# EAGLE design SparkFun_ESP32_Power_Control_Shield (EAGLE 7.7.0)
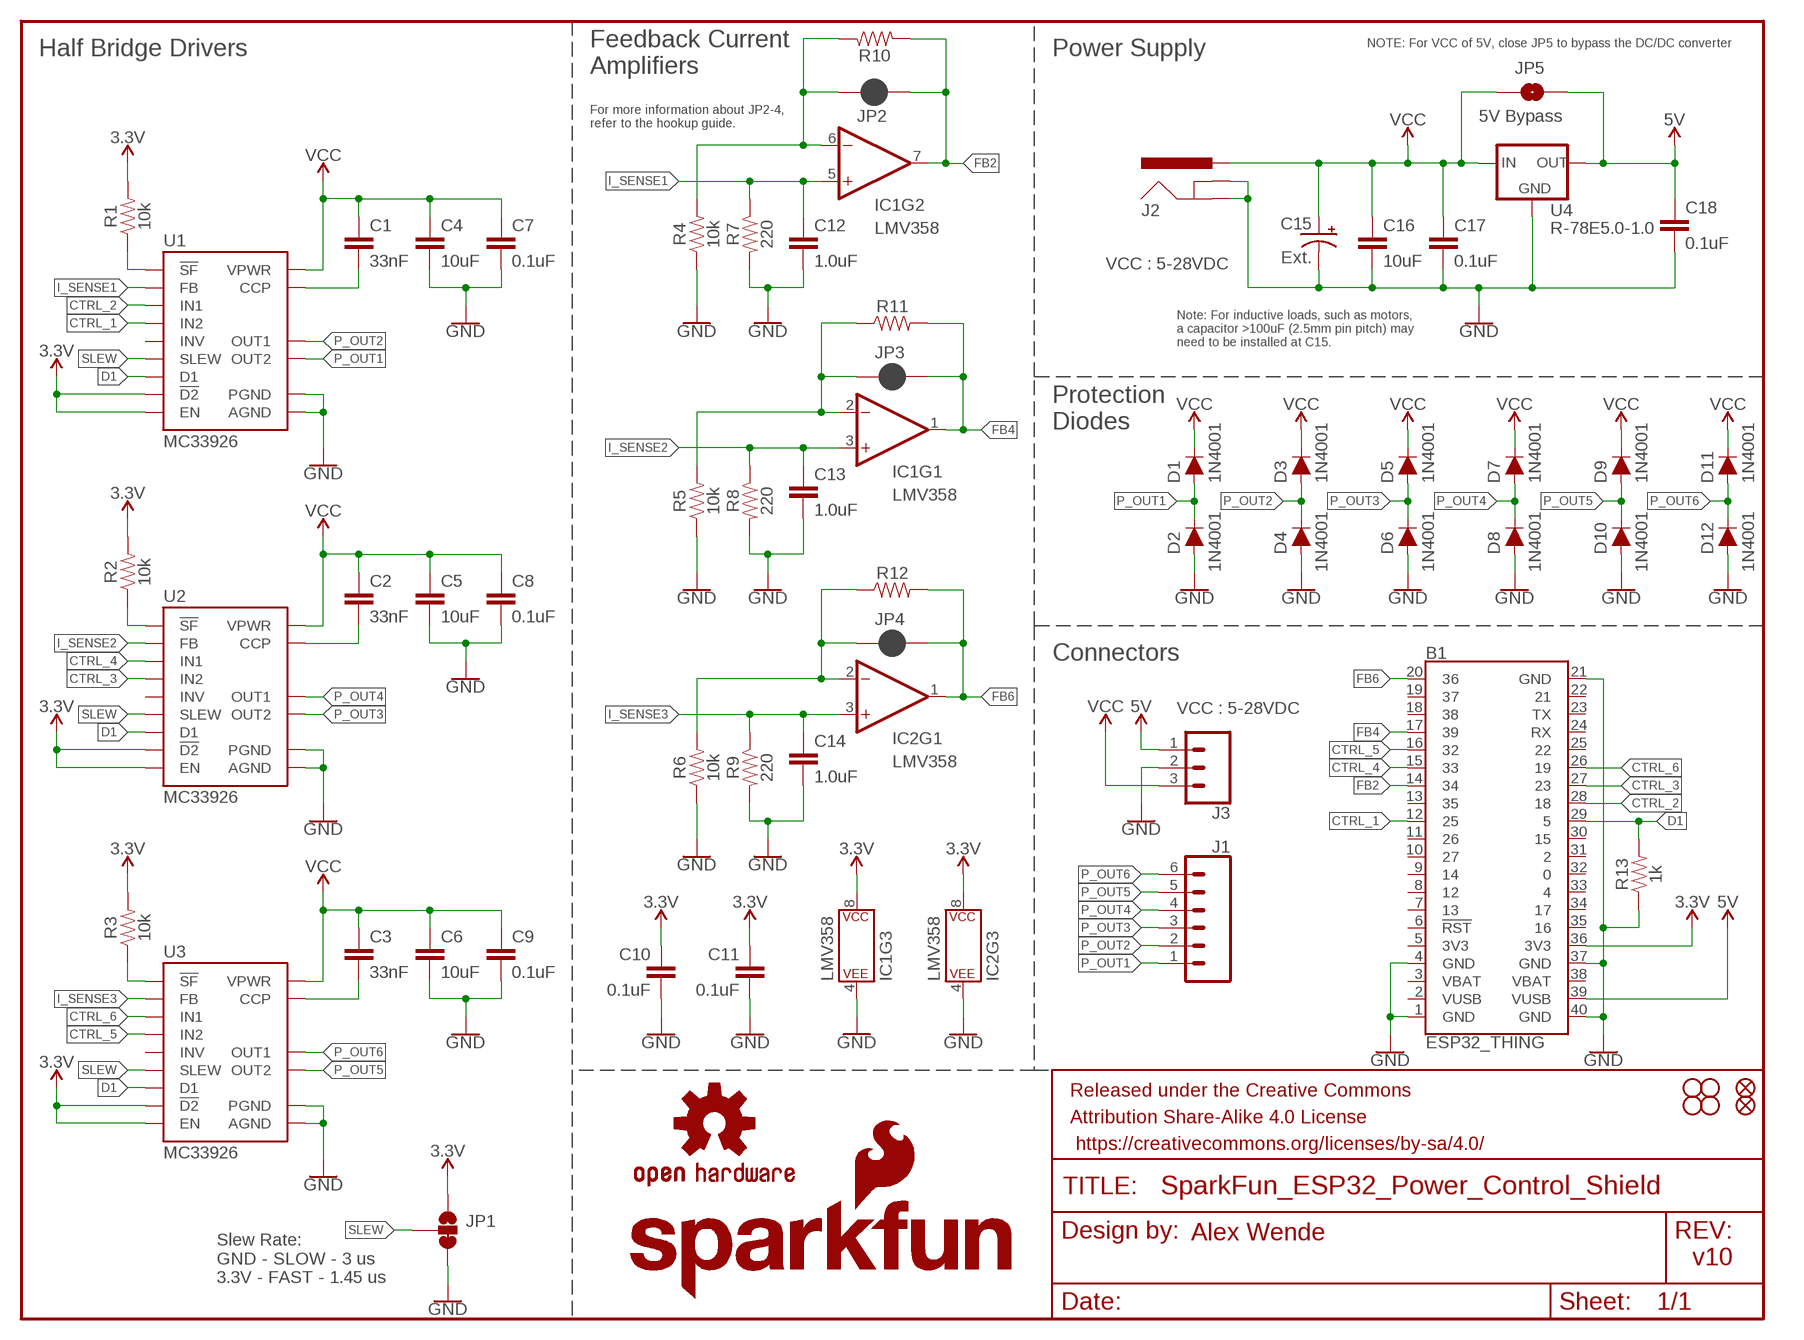
[diagram p0: schematic, sheet 1]

## Parts
B1  ESP32_THING  [ESP32_THING]
C1  33nF  33NF-0603-50V-10%  [0603]
C2  33nF  33NF-0603-50V-10%  [0603]
C3  33nF  33NF-0603-50V-10%  [0603]
C4  10uF  10UF-1210-50V-20%  [1210]
C5  10uF  10UF-1210-50V-20%  [1210]
C6  10uF  10UF-1210-50V-20%  [1210]
C7  0.1uF  0.1UF-0603-100V-10%  [0603]
C8  0.1uF  0.1UF-0603-100V-10%  [0603]
C9  0.1uF  0.1UF-0603-100V-10%  [0603]
C10  0.1uF  0.1UF-0603-100V-10%  [0603]
C11  0.1uF  0.1UF-0603-100V-10%  [0603]
C12  1.0uF  1.0UF-0603-16V-10%  [0603]
C13  1.0uF  1.0UF-0603-16V-10%  [0603]
C14  1.0uF  1.0UF-0603-16V-10%  [0603]
C15  Ext.  100UF-POLAR-RADIAL-2.5MM-25V-20%  [CPOL-RADIAL-2.5MM-6.5MM]
C16  10uF  10UF-1210-50V-20%  [1210]
C17  0.1uF  0.1UF-0603-100V-10%  [0603]
C18  0.1uF  0.1UF-0603-100V-10%  [0603]
D1  1N4001  DIODE-PTH  [DIODE-1N4001]
D2  1N4001  DIODE-PTH  [DIODE-1N4001]
D3  1N4001  DIODE-PTH  [DIODE-1N4001]
D4  1N4001  DIODE-PTH  [DIODE-1N4001]
D5  1N4001  DIODE-PTH  [DIODE-1N4001]
D6  1N4001  DIODE-PTH  [DIODE-1N4001]
D7  1N4001  DIODE-PTH  [DIODE-1N4001]
D8  1N4001  DIODE-PTH  [DIODE-1N4001]
D9  1N4001  DIODE-PTH  [DIODE-1N4001]
D10  1N4001  DIODE-PTH  [DIODE-1N4001]
D11  1N4001  DIODE-PTH  [DIODE-1N4001]
D12  1N4001  DIODE-PTH  [DIODE-1N4001]
FD1  FIDUCIALUFIDUCIAL  [FIDUCIAL-MICRO]
FD2  FIDUCIALUFIDUCIAL  [FIDUCIAL-MICRO]
FRAME1  FRAME-LETTER  [CREATIVE_COMMONS]
H1  STAND-OFF  [STAND-OFF]
H2  STAND-OFF  [STAND-OFF]
H3  STAND-OFF  [STAND-OFF]
H4  STAND-OFF  [STAND-OFF]
IC1  LMV358  OPAMP-DUALU  [SO08]
IC2  LMV358  OPAMP-DUALU  [SO08]
J1  CONN_063.5MM-6  [SCREWTERMINAL-3.5MM-6]
J2  POWER_JACKPTH_LOCK  [POWER_JACK_PTH_LOCK]
J3  CONN_03SCREW  [SCREWTERMINAL-3.5MM-3]
JP1  JUMPER-SMT_3_1-NC_TRACE_SILK  [SMT-JUMPER_3_1-NC_TRACE_SILK]
JP2  JUMPER-SMT_2_NC_PASTE_NO-SILK  [SMT-JUMPER_2_NC_PASTE_NO-SILK]
JP3  JUMPER-SMT_2_NC_PASTE_NO-SILK  [SMT-JUMPER_2_NC_PASTE_NO-SILK]
JP4  JUMPER-SMT_2_NC_PASTE_NO-SILK  [SMT-JUMPER_2_NC_PASTE_NO-SILK]
JP5  5V Bypass  JUMPER-SMT_2_NO_SILK  [SMT-JUMPER_2_NO_SILK]
LOGO1  SFE_LOGO_NAME_FLAME.2_INCH  [SFE_LOGO_NAME_FLAME_.2]
LOGO2  OSHW-LOGOM  [OSHW-LOGO-M]
R1  10k  10KOHM-0603-1/10W-1%  [0603]
R2  10k  10KOHM-0603-1/10W-1%  [0603]
R3  10k  10KOHM-0603-1/10W-1%  [0603]
R4  10k  10KOHM-0603-1/10W-1%  [0603]
R5  10k  10KOHM-0603-1/10W-1%  [0603]
R6  10k  10KOHM-0603-1/10W-1%  [0603]
R7  220  220OHM-0603-1/10W-1%  [0603]
R8  220  220OHM-0603-1/10W-1%  [0603]
R9  220  220OHM-0603-1/10W-1%  [0603]
R10  1KOHM-HORIZ-1/4W-1%  [AXIAL-0.3]
R11  1KOHM-HORIZ-1/4W-1%  [AXIAL-0.3]
R12  1KOHM-HORIZ-1/4W-1%  [AXIAL-0.3]
R13  1k  1KOHM-0603-1/10W-1%  [0603]
U1  MC33926  [32-PQFN]
U2  MC33926  [32-PQFN]
U3  MC33926  [32-PQFN]
U4  R-78E5.0-1.0  [DC-DC_CONVERTER_78XX]

## Nets
3.3V: B1.36(3V3) C10.1 C11.1 IC1.8(P$V+) IC2.8(P$V+) JP1.1 R1.2 R2.2 R3.2 U1.P$10(EN) U1.P$16(!D2) U2.P$10(EN) U2.P$16(!D2) U3.P$10(EN) U3.P$16(!D2)
5V: B1.39(VUSB) C18.1 J3.1 JP5.2 U4.VOUT(OUT)
CTRL_1: B1.12 U1.P$1(IN2)
CTRL_2: B1.28 U1.P$2(IN1)
CTRL_3: B1.27 U2.P$1(IN2)
CTRL_4: B1.15 U2.P$2(IN1)
CTRL_5: B1.16 U3.P$1(IN2)
CTRL_6: B1.26 U3.P$2(IN1)
D1: B1.29 R13.2 U1.P$26(D1) U2.P$26(D1) U3.P$26(D1)
FB2: B1.14 IC1.7(OUT) JP2.2 R10.P$2
FB4: B1.17 IC1.1(OUT) JP3.2 R11.P$2
FB6: B1.20 IC2.1(OUT) JP4.2 R12.P$2
GND: B1.1(GND) B1.4(GND) B1.21(GND) B1.37(GND) B1.40(GND) C4.2 C5.2 C6.2 C7.2 C8.2 C9.2 C10.2 C11.2 C12.2 C13.2 C14.2 C15.2(-) C16.2 C17.2 C18.2 D2.A D4.A D6.A D8.A D10.A D12.A IC1.4(P$V-) IC2.4(P$V-) J2.GND J2.GNDBREAK J3.2 JP1.3 R4.1 R5.1 R6.1 R7.2 R8.2 R9.2 R13.1 U1.P$5(AGND) U1.P$18(PGND) U1.P$19(PGND) U1.P$20(PGND) U1.P$22(PGND) U1.P$23(PGND) U1.P$24(PGND) U1.P$33(AGND) U2.P$5(AGND) U2.P$18(PGND) U2.P$19(PGND) U2.P$20(PGND) U2.P$22(PGND) U2.P$23(PGND) U2.P$24(PGND) U2.P$33(AGND) U3.P$5(AGND) U3.P$18(PGND) U3.P$19(PGND) U3.P$20(PGND) U3.P$22(PGND) U3.P$23(PGND) U3.P$24(PGND) U3.P$33(AGND) U4.GND
I_SENSE1: C12.1 IC1.5(+IN) R7.1 U1.P$8(FB)
I_SENSE2: C13.1 IC1.3(+IN) R8.1 U2.P$8(FB)
I_SENSE3: C14.1 IC2.3(+IN) R9.1 U3.P$8(FB)
N$2: IC1.6(-IN) JP2.1 R4.2 R10.P$1
N$4: IC2.2(-IN) JP4.1 R6.2 R12.P$1
N$5: IC1.2(-IN) JP3.1 R5.2 R11.P$1
N$6: R2.1 U2.P$21(!SF)
N$7: C2.2 U2.P$32(CCP)
N$9: R3.1 U3.P$21(!SF)
N$10: R1.1 U1.P$21(!SF)
N$11: C1.2 U1.P$32(CCP)
N$12: C3.2 U3.P$32(CCP)
P_OUT1: D1.A D2.C J1.1 U1.P$27(OUT2) U1.P$28(OUT2) U1.P$29(OUT2) U1.P$30(OUT2)
P_OUT2: D3.A D4.C J1.2 U1.P$12(OUT1) U1.P$13(OUT1) U1.P$14(OUT1) U1.P$15(OUT1)
P_OUT3: D5.A D6.C J1.3 U2.P$27(OUT2) U2.P$28(OUT2) U2.P$29(OUT2) U2.P$30(OUT2)
P_OUT4: D7.A D8.C J1.4 U2.P$12(OUT1) U2.P$13(OUT1) U2.P$14(OUT1) U2.P$15(OUT1)
P_OUT5: D9.A D10.C J1.5 U3.P$27(OUT2) U3.P$28(OUT2) U3.P$29(OUT2) U3.P$30(OUT2)
P_OUT6: D11.A D12.C J1.6 U3.P$12(OUT1) U3.P$13(OUT1) U3.P$14(OUT1) U3.P$15(OUT1)
SLEW: JP1.2 U1.P$3(SLEW) U2.P$3(SLEW) U3.P$3(SLEW)
VCC: C1.1 C2.1 C3.1 C4.1 C5.1 C6.1 C7.1 C8.1 C9.1 C15.1(+) C16.1 C17.1 D1.C D3.C D5.C D7.C D9.C D11.C J2.PWR J3.3 JP5.1 U1.P$4(VPWR) U1.P$6(VPWR) U1.P$11(VPWR) U1.P$31(VPWR) U2.P$4(VPWR) U2.P$6(VPWR) U2.P$11(VPWR) U2.P$31(VPWR) U3.P$4(VPWR) U3.P$6(VPWR) U3.P$11(VPWR) U3.P$31(VPWR) U4.VIN(IN)
Unconnected: B1.2(VUSB) B1.3(VBAT) B1.5(3V3) B1.6(!RST!) B1.7 B1.8 B1.9 B1.10 B1.11 B1.13 B1.18 B1.19 B1.22 B1.23(TX) B1.24(RX) B1.25 B1.30 B1.31 B1.32 B1.33 B1.34 B1.35 B1.38(VBAT) IC2.5(+IN) IC2.6(-IN) IC2.7(OUT) U1.P$7(INV) U2.P$7(INV) U3.P$7(INV)

## Notes on the sheet
- NOTE: For VCC of 5V, close JP5 to bypass the DC/DC converter
- Half Bridge Drivers | Power Supply
- Feedback Current
  Amplifiers
- For more information about JP2-4,
  refer to the hookup guide.
- VCC : 5-28VDC
- Note: For inductive loads, such as motors,
  a capacitor >100uF (2.5mm pin pitch) may
  need to be installed at C15.
- Protection
  Diodes
- Connectors
- VCC : 5-28VDC
- Alex Wende
- v10
- Slew Rate:
  GND - SLOW - 3 us
  3.3V - FAST - 1.45 us

## Library data of the parts
B1 = SparkFun-Boards:ESP32_THING: SparkFun ESP32 Thing Board Pins, silkscreen, and logos matching the layout of the SparkFun ESP32 Thing <https://www.sparkfun.com/products/13907> Dimensions: 2.32" x 1.00"; SF_ID: DEV-13907
C1-C3 = SparkFun-Capacitors:33NF: 33nF ceramic capacitors A capacitor is a passive two-terminal electrical component used to store electrical energy temporarily in an electric field.; PROD_ID: CAP-07887
C4-C6 C16 = SparkFun-Capacitors:10UF: 10.0µF ceramic capacitors A capacitor is a passive two-terminal electrical component used to store electrical energy temporarily in an electric field.; PROD_ID: CAP-09824
C7-C11 C17 C18 = SparkFun-Capacitors:0.1UF: 0.1µF ceramic capacitors A capacitor is a passive two-terminal electrical component used to store electrical energy temporarily in an electric field.; PROD_ID: CAP-08390
C12-C14 = SparkFun-Capacitors:1.0UF: 1µF ceramic capacitors A capacitor is a passive two-terminal electrical component used to store electrical energy temporarily in an electric field.; PROD_ID: CAP-00868
C15 = SparkFun-Capacitors:100UF-POLAR: 100µF polarized capacitors A capacitor is a passive two-terminal electrical component used to store electrical energy temporarily in an electric field.; PROD_ID: CAP-08439; VALUE: 100uF
D1-D12 = SparkFun-DiscreteSemi:DIODE: Diode These are standard reverse protection diodes and small signal diodes. SparkFun Products: SparkFun SparkPunk Sound Kit <https://www.sparkfun.com/products/11177> SparkFun ESP8266 Thing <https://www.sparkfun.com/products/13231>; PROD_ID: DIO-09176; VALUE: 1A/50V/1.1V
FD1 FD2 = SparkFun-Aesthetics:FIDUCIAL: Fiducial Alignment Points Point-of-reference for pick-and-place machines and other optical instruments.
FRAME1 = SparkFun-Aesthetics:FRAME-LETTER: Schematic Frame - Letter Standard 8.5x11 US Letter frame
H1-H4 = SparkFun-Hardware:STAND-OFF: Stand Off Drill holes for mechanically mounting via screws, standoffs, etc. Note: Use the keepout ring to avoid running the screw head into surrounding components. Variant Overviews STAND-OFF - Mechanical footprint for a #4 phillips button head screw. STAND-OFF-TIGHT - Mechanical footprint for a #4 phillips button head screw, Example SparkFun Products Screw - Phillips Head (1/4", 4-40, 10 pack) <https://www.sparkfun.com/products/10453> (PRT-10453) Screw - Phillips Head (1/2", 4-40, 10 pack) <https://www.sparkfun.com/products/10452> (PRT-10452) Screw - Phillips Head (3/4", 4-40, 10 pack) <https://www.sparkfun.com/products/10451> (PRT-10451) Screw - Phillips Head (1", 4-40, 10 pack) <https://www.sparkfun.com/products/10450> (PRT-10450)
IC1 IC2 = SparkFun-IC-Amplifiers:OPAMP-DUAL: Generic op-amp footprint This component is for the standard 358 pinning of a dual op-amp From the LM358 datasheet: Pin 1: Output A Pin 2: Inverting Input A Pin 3: Non-Inverting Input A Pin 4: Gnd Pin 5: Non-Inverting Input B Pin 6: Inverting Input B Pin 7: Output B Pin 8: V+; PROD_ID: IC-09657; VALUE: OP-AMP
J1 = SparkFun-Connectors:CONN_06: Multi connection point. Often used as Generic Header-pin footprint for 0.1 inch spaced/style header connections On any of the 0.1 inch spaced packages, you can populate with these: Break Away Headers - Straight <https://www.sparkfun.com/products/116> (PRT-00116) Break Away Male Headers - Right Angle <https://www.sparkfun.com/products/553> (PRT-00553) Female Headers <https://www.sparkfun.com/products/115> (PRT-00115) Break Away Headers - Machine Pin <https://www.sparkfun.com/products/117> (PRT-00117) Break Away Female Headers - Swiss Machine Pin <https://www.sparkfun.com/products/743> (PRT-00743) Arduino Stackable Header - 6 Pin <https://www.sparkfun.com/products/9280> (PRT-09280) For SCREWTERMINALS and SPRING TERMINALS visit here: Screw Terimnals on SparkFun.com <https://www.sparkfun.com/search/results?term=Screw+Terminals> (5mm/3.5mm/2.54mm spacing) This device is also useful as a general connection point to wire up your design to another part of your project. Our various solder wires solder well into these plated through hole pads. Hook-Up Wire - Assortment (Stranded, 22 AWG) <https://www.sparkfun.com/products/11375> (PRT-11375) Hook-Up Wire - Assortment (Solid Core, 22 AWG) <https://www.sparkfun.com/products/11367> (PRT-11367) View the entire wire category on our website here <https://www.sparkfun.com/categories/141>; PROD_ID: CONN-13617
J2 = SparkFun-Connectors:POWER_JACK: Power Jack Connector This is the standard 5.5mm barrel jack for power. The PTH is the most common, proven, reliable, footprint. The Slot footprint only works if the mill layer is transmitted to the PCB fab house so be warned. Here are the connectors we sell at SparkFun: DC Barrel Power Jack/Connector <https://www.sparkfun.com/products/119> (PRT-00119) DC Barrel Power Jack/Connector (SMD) <https://www.sparkfun.com/products/12748> (PRT-12748) DC Barrel Jack Adapter - Breadboard Compatible <https://www.sparkfun.com/products/10811> (PRT-10811) It is used on this SparkFun product (and many, many others): SparkFun RedBoard - Programmed with Arduino <https://www.sparkfun.com/products/12757> (DEV-12757) Also, if you need a mating power supply or connector, please check these out: Wall Adapter Power Supply - 9VDC 650mA <https://www.sparkfun.com/products/298> (TOL-00298) DC Barrel Jack Adapter - Male <https://www.sparkfun.com/products/10287> (PRT-10287); PROD_ID: CONN-08197; SF_ID: PRT-00119
J3 = SparkFun-Connectors:CONN_03: Multi connection point. Often used as Generic Header-pin footprint for 0.1 inch spaced/style header connections On any of the 0.1 inch spaced packages, you can populate with these: Break Away Headers - Straight <https://www.sparkfun.com/products/116> (PRT-00116) Break Away Male Headers - Right Angle <https://www.sparkfun.com/products/553> (PRT-00553) Female Headers <https://www.sparkfun.com/products/115> (PRT-00115) Break Away Headers - Machine Pin <https://www.sparkfun.com/products/117> (PRT-00117) Break Away Female Headers - Swiss Machine Pin <https://www.sparkfun.com/products/743> (PRT-00743) Stackable Header - 3 Pin (Female, 0.1") <https://www.sparkfun.com/products/13875> (PRT-13875) For SCREWTERMINALS and SPRING TERMINALS visit here: Screw Terimnals on SparkFun.com <https://www.sparkfun.com/search/results?term=Screw+Terminals> (5mm/3.5mm/2.54mm spacing) This device is also useful as a general connection point to wire up your design to another part of your project. Our various solder wires solder well into these plated through hole pads. Hook-Up Wire - Assortment (Stranded, 22 AWG) <https://www.sparkfun.com/products/11375> (PRT-11375) Hook-Up Wire - Assortment (Solid Core, 22 AWG) <https://www.sparkfun.com/products/11367> (PRT-11367) View the entire wire category on our website here <https://www.sparkfun.com/categories/141> Special notes: Molex polarized connector foot print use with SKU : PRT-08232 with associated crimp pins and housings.; PROD_ID: CONN-08288; SF_ID: PRT-08235
JP1 = SparkFun-Jumpers:JUMPER-SMT_3_1-NC_TRACE: Normally closed trace jumper (1 of 2 connections) This jumper has a trace between two pads so it's normally closed (NC). The other connection is normally open (NO). Use a razor knife to open the connection. For best results follow the IPC guidelines for cutting traces: Cutout at least 0.063 mm (0.005 in). Remove all loose material to clean up the cut area. Seal the cut with an approved epoxy. Reapply solder to reclose the connection, or to close the NO connection.
JP2-JP4 = SparkFun-Jumpers:JUMPER-SMT_2_NC_PASTE: Normally closed solder jumper This jumper has an aperture in the stencil to allow solder paste to bridge the split in the wire so it's normally closed (NC). Wick off the solder to open the connection. Reapply solder to reclose the connection.
JP5 = SparkFun-Jumpers:JUMPER-SMT_2_NO: Normally open jumper This jumper has two pads in close proximity to each other. Apply solder to close the connection. Round pads are easier to solder for beginners, but are a lot larger. SparkFun Product that uses the round pads: SparkFun EL Sequencer <https://www.sparkfun.com/products/12781>
LOGO1 = SparkFun-Aesthetics:SFE_LOGO_NAME_FLAME: SparkFun Font Logo w/ Flame This is the SparkFun full logo. The logo on the schematic will always be the same size; the package variant is the height of the flame part of the logo. Default layer for the logo on the board is tSilk.
LOGO2 = SparkFun-Aesthetics:OSHW-LOGO: Open-Source Hardware (OSHW) Logo This logo indicates the piece of hardware it is found on incorporates a OSHW license and/or adheres to the definition of open source hardware found here: http://freedomdefined.org/OSHW
R1-R6 = SparkFun-Resistors:10KOHM: 10kΩ resistor A resistor is a passive two-terminal electrical component that implements electrical resistance as a circuit element. Resistors act to reduce current flow, and, at the same time, act to lower voltage levels within circuits. - Wikipedia; PROD_ID: RES-00824
R7-R9 = SparkFun-Resistors:220OHM: 220Ω resistor A resistor is a passive two-terminal electrical component that implements electrical resistance as a circuit element. Resistors act to reduce current flow, and, at the same time, act to lower voltage levels within circuits. - Wikipedia; PROD_ID: RES-07861
R10-R12 = SparkFun-Resistors:1KOHM: 1kΩ resistor A resistor is a passive two-terminal electrical component that implements electrical resistance as a circuit element. Resistors act to reduce current flow, and, at the same time, act to lower voltage levels within circuits. - Wikipedia; PROD_ID: RES-12182; VALUE: 1k
R13 = SparkFun-Resistors:1KOHM: 1kΩ resistor A resistor is a passive two-terminal electrical component that implements electrical resistance as a circuit element. Resistors act to reduce current flow, and, at the same time, act to lower voltage levels within circuits. - Wikipedia; PROD_ID: RES-07856
U1-U3 = SparkFun_ESP32_Power_Control_Shield_Temp:MC33926; PROD_ID: IC-13616
U4 = SparkFun-IC-Power:R-78E5.0-1.0: Recom Power 5V 1A DC/DC Converter The Recom R-78E5.0-X.X is a compact DC/DC converter module that is a pin for pin drop-in replacement for the LM7805 linear voltage regulator. Specifications: Input Range: 7-28V Output Voltage: 5V Output Current: 1A Max Efficiency: 91% Datasheet <https://www.recom-power.com/pdf/Innoline/R-78Exx-1.0.pdf>; PROD_ID: COM-13655

## Board
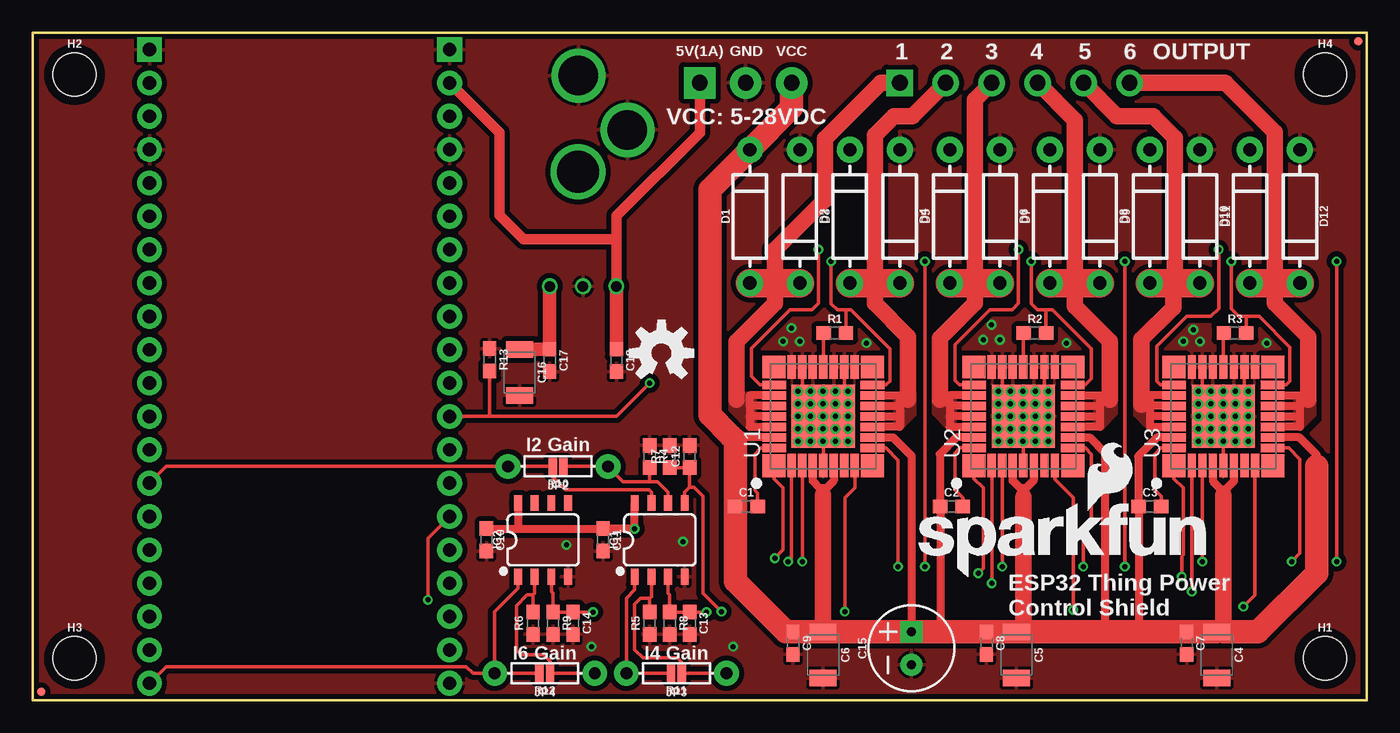
[diagram p1: board, top side]
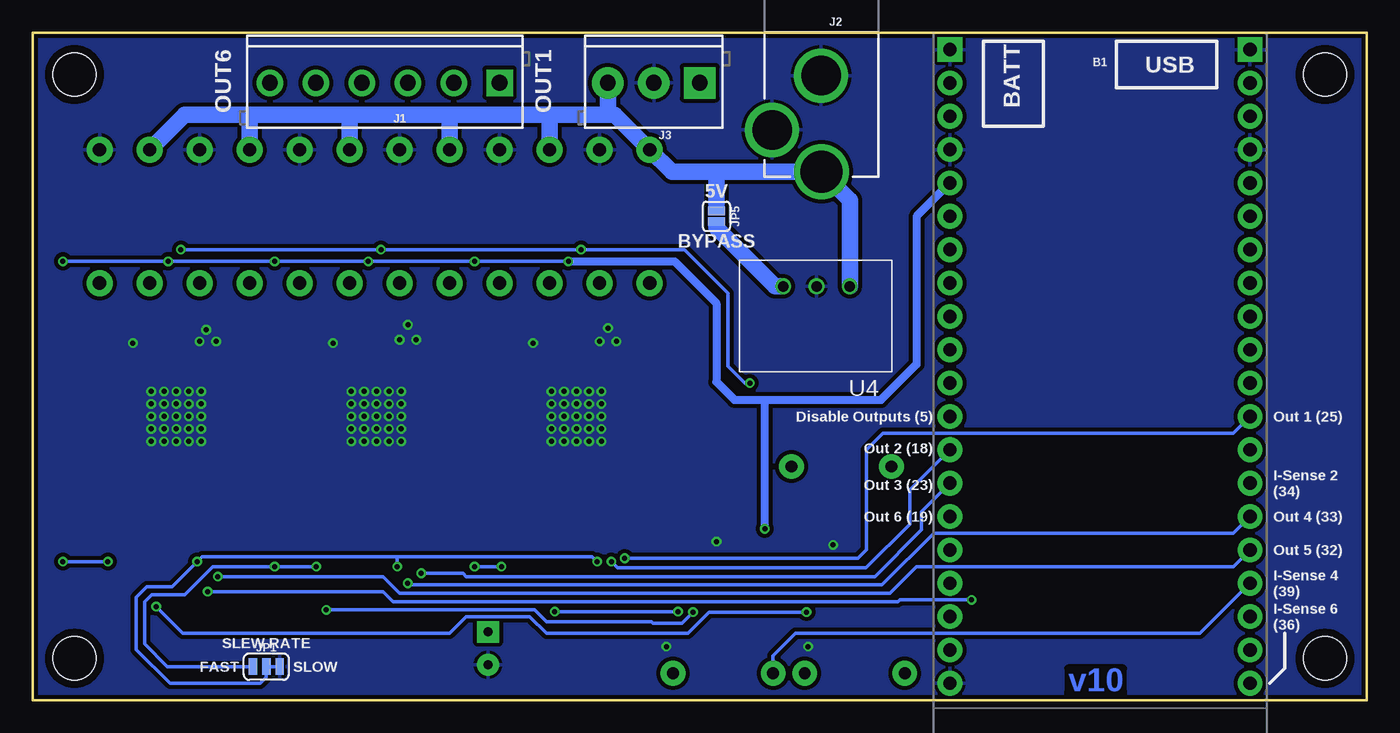
[diagram p2: board, bottom side, seen from below]

Size 101.6 x 50.8 mm. Coordinates in mm from the lower left corner, seen from the top.
Outline: 0,0 101.6,0 101.6,50.8 0,50.8 0,0
Copper layers (1*16): Top 0.035mm / dielectric 1.5mm / Bottom 0.035mm
Design rules "SparkFun-2-layer-TIGHT": minimum track width 7mil, minimum drill 15mil, track to track 7mil, track to pad 7mil, pad to pad 7mil, via to via 7mil, smd to smd 7mil, copper to edge 7mil, drill to drill 7mil, minimum pad ring 7mil, minimum via ring 7mil, stop-mask expansion 4mil, vias tented up to drill 25mil, thermal gap 10mil

### Footprints (pad centres in the part's own frame; a part is rotated, then mirrored left to right if it is on the bottom)
ESP32_THING = drill 1.016 pad 1.88 square: 1 1.27,1.27; 40 24.13,1.27 | drill 1.016 pad 1.88: 2 1.27,3.81; 3 1.27,6.35; 4 1.27,8.89; 5 1.27,11.43; 6 1.27,13.97; 7 1.27,16.51; 8 1.27,19.05; 9 1.27,21.59; 10 1.27,24.13; 11 1.27,26.67; 12 1.27,29.21; 13 1.27,31.75; 14 1.27,34.29; 15 1.27,36.83; 16 1.27,39.37; 17 1.27,41.91; 18 1.27,44.45; 19 1.27,46.99; 20 1.27,49.53; 21 24.13,49.53; 22 24.13,46.99; 23 24.13,44.45; 24 24.13,41.91; 25 24.13,39.37; 26 24.13,36.83; 27 24.13,34.29; 28 24.13,31.75; 29 24.13,29.21; 30 24.13,26.67; 31 24.13,24.13; 32 24.13,21.59; 33 24.13,19.05; 34 24.13,16.51; 35 24.13,13.97; 36 24.13,11.43; 37 24.13,8.89; 38 24.13,6.35; 39 24.13,3.81
0603 = smd 1.1 x 1: 1 -0.85,0; 2 0.85,0
1210 = smd 1.27 x 2.06: 1 -1.755,0; 2 1.755,0
CPOL-RADIAL-2.5MM-6.5MM = drill 0.7 pad 1.651 square: 1 1.25,0 | drill 0.7 pad 1.651: 2 -1.25,0
DIODE-1N4001 = drill 1 pad 1.981: A -5.08,0; C 5.08,0
FIDUCIAL-MICRO = smd 0.635 x 0.635: 1 0,0
STAND-OFF = hole 3.302: 0,0
SO08 = smd 0.6 x 1.2: 1 -1.905,-2.8; 2 -0.635,-2.8; 3 0.635,-2.8; 4 1.905,-2.8; 5 1.905,2.8; 6 0.635,2.8; 7 -0.635,2.8; 8 -1.905,2.8
SCREWTERMINAL-3.5MM-6 = drill 1.2 pad 2.032 square: 1 0,0 | drill 1.2 pad 2.032: 2 3.5,0; 3 7,0; 4 10.5,0; 5 14,0; 6 17.5,0
POWER_JACK_PTH_LOCK = drill 2.997 pad 4.115: GND 0.025,6.557; GNDBREAK 3.762,10.7 | drill 3.2 pad 4.115: PWR 0,13.878
SCREWTERMINAL-3.5MM-3 = drill 1.2 pad 2.413 square: 1 0,0 | drill 1.2 pad 2.413: 2 3.5,0; 3 7,0
SMT-JUMPER_3_1-NC_TRACE_SILK = smd 0.635 x 1.27: 1 -1.016,0; 2 0,0; 3 1.016,0
SMT-JUMPER_2_NC_PASTE_NO-SILK = smd 0.635 x 1.27: 1 -0.406,0; 2 0.406,0
SMT-JUMPER_2_NO_SILK = smd 0.635 x 1.27: 1 -0.406,0; 2 0.406,0
AXIAL-0.3 = drill 0.9 pad 1.88: P$1 -3.81,0; P$2 3.81,0
32-PQFN = smd 1.75 x 1.75: P$1 -3.754,3.753; P$9 -3.754,-3.767; P$17 3.766,-3.767; P$25 3.766,3.753 | smd 1.8 x 0.635: P$2 -3.74,2.393; P$3 -3.74,1.593; P$4 -3.74,0.793; P$5 -3.74,-0.007; P$6 -3.74,-0.807; P$7 -3.74,-1.607; P$8 -3.74,-2.407; P$18 3.752,-2.407; P$19 3.752,-1.607; P$20 3.752,-0.807; P$21 3.752,-0.007; P$22 3.752,0.793; P$23 3.752,1.593; P$24 3.752,2.393 | smd 0.635 x 1.8: P$10 -2.394,-3.753; P$11 -1.594,-3.753; P$12 -0.794,-3.753; P$13 0.006,-3.753; P$14 0.806,-3.753; P$15 1.606,-3.753; P$16 2.406,-3.753; P$26 2.406,3.739; P$27 1.606,3.739; P$28 0.806,3.739; P$29 0.006,3.739; P$30 -0.794,3.739; P$31 -1.594,3.739; P$32 -2.394,3.739 | smd 4.8 x 4.8: P$33 0.006,-0.007
DC-DC_CONVERTER_78XX = drill 0.8: GND 0,0; VIN -2.54,0; VOUT 2.54,0

### Placement (x,y rotation side)
B1  7.62,50.8 180 bottom
C1  54.36,14.73 0 top
C2  69.98,14.73 0 top
C3  85.09,14.73 0 top
C4  90.17,3.43 270 top
C5  74.93,3.43 270 top
C6  60.2,3.43 270 top
C7  87.88,4.33 270 top
C8  72.64,4.33 270 top
C9  57.91,4.33 270 top
C10  34.54,12.19 270 top
C11  43.43,12.19 270 top
C12  50.04,18.54 90 top
C13  50.04,5.84 270 top
C14  41.15,5.84 270 top
C15  66.93,3.94 90 top
C16  37.08,24.94 270 top
C17  39.37,25.86 270 top
C18  44.45,25.86 270 top
D1  54.61,36.83 90 top
D2  58.42,36.83 270 top
D3  62.23,36.83 90 top
D4  66.04,36.83 270 top
D5  69.85,36.83 90 top
D6  73.66,36.83 270 top
D7  77.47,36.83 90 top
D8  81.28,36.83 270 top
D9  85.09,36.83 90 top
D10  88.9,36.83 270 top
D11  92.71,36.83 90 top
D12  96.52,36.83 270 top
FD1  100.97,50.16 0 top
FD2  0.64,0.64 0 top
FRAME1  12.7,-22.86 0 top  (outside the outline)
H1  98.42,3.17 0 top
H2  3.17,47.62 0 top
H3  3.17,3.17 0 top
H4  98.42,47.62 0 top
IC1  47.75,12.19 0 top
IC2  38.86,12.19 0 top
J1  66.04,46.99 180 bottom
J2  41.53,54.1 180 bottom
J3  50.8,46.99 180 bottom
JP1  83.82,2.54 0 bottom
JP2  40.01,17.78 180 top
JP3  49.02,2.03 180 top
JP4  38.99,2.03 180 top
JP5  49.53,36.83 270 bottom
LOGO1  66.8,9.27 0 top
LOGO2  47.88,26.42 0 top
R1  61.09,27.94 0 top
R2  76.33,27.94 0 top
R3  91.57,27.94 0 top
R4  46.99,18.54 270 top
R5  46.99,5.84 90 top
R6  38.1,5.84 90 top
R7  48.51,18.54 90 top
R8  48.51,5.84 270 top
R9  39.62,5.84 270 top
R10  40.01,17.78 180 top
R11  49.02,2.03 180 top
R12  38.99,2.03 180 top
R13  34.8,25.91 270 top
U1  60.2,21.59 90 top
U2  75.44,21.59 90 top
U3  90.68,21.59 90 top
U4  41.91,31.5 180 bottom
U$1  [ORDERING_INSTRUCTIONS]  -1.27,-27.94 0 top  (outside the outline)

### Tracks (layer width: path | path; a pad name or v marks a point on that pad's centre or on a via)
3.3V  (via drill 0.38)
  Top 0.254: U1.P$16 64.99,24 65.28,24.29 65.28,26.74 62.3,29.72 61.94,29.72 | U2.P$16 80.18,24 80.64,24.46 80.64,26.73 77.66,29.72 77.18,29.72 | U3.P$16 95.47,24 95.76,24.28 95.76,26.86 93.4,29.21 92.42,29.21 | v99.31,33.4 v99.31,10.54 | v83.19,10.16 v83.19,33.4 | v67.94,10.16 v67.94,33.4 | v91.29,33.4 91.29,29.79 91.87,29.21 92.42,29.21 | 92.42,29.21 R3.2 | R2.2 77.18,29.72 | v76.05,33.4 76.05,30.19 76.52,29.72 77.18,29.72 | R1.2 61.94,29.72 | v95.89,10.54 96.52,11.18 96.52,18.34 95.66,19.2 U3.P$10 | v80.01,10.16 80.01,13.21 80.64,13.84 80.64,18.73 80.18,19.2 U2.P$10 | v65.91,10.16 65.91,18.27 64.99,19.2 U1.P$10 | 61.94,29.72 61.28,29.72 60.81,30.19 v60.81,33.4
  Top 0.61: IC1.8 v45.85,13.04 C11.1 36.96,13.04 | C10.1 36.96,13.04 | IC2.8 36.96,13.04
  Bottom 0.254: v99.31,33.4 v91.29,33.4 v83.19,33.4 v76.05,33.4 v67.94,33.4 v60.81,33.4 | v99.31,10.54 v95.89,10.54 | v80.01,10.16 v83.19,10.16 87.88,10.16 90.04,8 92.55,8 93.09,7.46 93.09,4.27 91.36,2.54 JP1.1 | v67.94,10.16 v65.91,10.16
  Bottom 0.61: B1.36 34.29,36.83 34.29,25.56 36.99,22.86 45.85,22.86 | v60.81,33.4 52.71,33.4 49.53,30.22 49.53,24.23 48.16,22.86 45.85,22.86 | v45.85,13.04 45.85,22.86
5V
  Top 0.813: J3.1 50.8,43.2 44.45,36.85 44.45,35.08 | 44.45,35.08 U4.VOUT | 44.45,35.08 37.38,35.08 35.56,36.89 35.56,43.18 B1.39
  Top 1.016: U4.VOUT C18.1
  Bottom 0.254: 49.53,35.94 JP5.2
  Bottom 1.27: U4.VOUT 45.09,31.5 49.53,35.94
CTRL_1  (via drill 0.38)
  Top 0.254: U1.P$1 56.45,16.86 57.15,16.15 57.15,11.43 v56.52,10.79
  Bottom 0.254: v56.52,10.79 38.73,10.79 38.1,11.43 38.1,19.05 36.83,20.32 10.16,20.32 B1.12
CTRL_2  (via drill 0.38)
  Top 0.254: U1.P$2 57.8,10.81 v57.53,10.54
  Bottom 0.254: B1.28 34.8,16 34.8,13.39 38.13,10.06 57.05,10.06 v57.53,10.54
CTRL_3  (via drill 0.38)
  Top 0.254: U2.P$1 71.69,16.86 72.39,16.15 72.39,10.03 v72.01,9.65
  Bottom 0.254: v72.01,9.65 68.83,9.65 68.58,9.4 37.47,9.4 33.91,12.96 33.91,14.35 B1.27
CTRL_4  (via drill 0.38)
  Top 0.254: U2.P$2 v73.05,8.89
  Bottom 0.254: v73.05,8.89 72.92,8.76 36.9,8.76 32.97,12.7 10.16,12.7 B1.15
CTRL_5  (via drill 0.38)
  Top 0.254: U3.P$1 86.92,16.86 87.63,16.15 87.63,11.05 87.5,10.92 v87.5,9.4
  Bottom 0.254: v87.5,9.4 74.93,9.4 73.66,8.13 36.32,8.13 34.29,10.16 10.16,10.16 B1.16
CTRL_6  (via drill 0.38)
  Top 0.254: U3.P$2 v88.28,8.26 | B1.26 30.1,12.32 v30.1,7.62
  Bottom 0.254: v88.28,8.26 74.93,8.26 74.17,7.49 35.69,7.49 35.56,7.62 v30.1,7.62
D1  (via drill 0.38)
  Top 0.254: U1.P$26 55.38,24 54.74,24.64 54.74,26.8 57.66,29.72 59.36,29.72 59.84,30.2 v59.84,34.29 | U2.P$26 70.59,24 70.23,24.36 70.23,27.05 72.9,29.72 74.6,29.72 75.08,30.2 v75.08,34.29 | U3.P$26 85.89,24 85.6,24.29 85.6,26.92 87.88,29.21 89.73,29.21 90.32,29.8 v90.32,34.29 | R13.2 34.8,21.59 | v46.99,24.13 44.45,21.59 34.8,21.59 | B1.29 34.8,21.59
  Bottom 0.254: v90.32,34.29 v75.08,34.29 v59.84,34.29 51.94,34.29 48.64,30.99 48.64,25.4 47.37,24.13 v46.99,24.13
FB2
  Top 0.254: IC1.7 47.12,15.82 46.94,16 40.59,16 39.6,16.99 JP2.2 R10.P$2 10.16,17.78 B1.14
FB4
  Top 0.254: IC1.1 45.85,8.38 45.21,7.75 R11.P$2 JP3.2
  Bottom 0.254: R11.P$2 45.21,3.38 43.51,5.08 12.7,5.08 B1.17
FB6
  Top 0.254: B1.20 10.16,2.54 33.02,2.54 33.53,2.03 R12.P$2 | JP4.2 R12.P$2 | IC2.1 36.96,8.51 35.18,6.73 R12.P$2
GND  (via drill 0.38)
  Top 0.254: U1.P$5 60.2,19.68 v59.24,19.68 | U2.P$5 75.44,19.68 v74.48,19.68 | U3.P$5 90.69,19.68 v89.72,19.68 | U1.P$23 58.6,21.59 U1.P$33 | U1.P$19 61.8,21.59 61.09,21.59 | U2.P$23 73.84,21.59 74.93,21.59 | U2.P$19 77.05,21.59 76.2,21.59 | U3.P$23 89.08,21.59 92.28,21.59 U3.P$19
  other vias: 58.29,23.5 59.24,23.5 60.19,23.5 61.13,23.5 62.1,23.5 58.29,19.68 58.29,20.64 58.29,21.59 58.29,22.54 59.24,22.54 59.24,21.59 59.24,20.64 60.19,22.54 60.19,21.59 60.19,20.64 60.19,19.68 61.13,22.54 61.13,21.59 61.13,20.64 61.13,19.68 62.1,22.54 62.1,21.59 62.1,20.64 62.1,19.68 73.53,23.5 74.48,23.5 75.43,23.5 76.37,23.5 77.34,23.5 73.53,19.68 73.53,20.64 73.53,21.59 73.53,22.54 74.48,22.54 74.48,21.59 74.48,20.64 75.43,22.54 75.43,21.59 75.43,20.64 75.43,19.68 76.37,22.54 76.37,21.59 76.37,20.64 76.37,19.68 77.34,22.54 77.34,21.59 77.34,20.64 77.34,19.68 88.77,23.5 89.72,23.5 90.67,23.5 91.61,23.5 92.58,23.5 88.77,19.68 88.77,20.64 88.77,21.59 88.77,22.54 89.72,22.54 89.72,21.59 89.72,20.64 90.67,22.54 90.67,21.59 90.67,20.64 90.67,19.68 91.61,22.54 91.61,21.59 91.61,20.64 91.61,19.68 92.58,22.54 92.58,21.59 92.58,20.64 92.58,19.68 57.15,27.3 58.42,27.3 57.78,28.32 63.5,27.18 72.39,27.43 73.66,27.43 73.03,28.57 78.74,27.18 87.63,27.3 88.9,27.3 88.39,28.19 93.98,27.18 42.55,4.06 53.34,4.06 40.64,11.81 49.53,12.06
  pour Bottom (isolate 0.305, rank 2): 0,50.8 0,0 101.6,0 101.6,50.8
  pour Top (isolate 0.381, rank 2): 0,50.8 0,0 101.6,0 101.6,50.8
I_SENSE1  (via drill 0.38)
  Top 0.254: R7.1 C12.1 50.04,16.2 | U1.P$8 62.6,16.15 61.85,15.39 v61.85,6.73 | v52.45,6.73 51.05,8.13 51.05,15.52 50.38,16.2 50.04,16.2 | IC1.5 49.66,15.82 50.04,16.2
  Bottom 0.254: v52.45,6.73 v61.85,6.73
I_SENSE2  (via drill 0.38)
  Top 0.254: U2.P$8 77.84,16.8 79.25,15.4 v79.25,6.86 | IC1.3 48.39,8.13 48.51,8 R8.1 C13.1 v51.31,6.69
  Bottom 0.254: v51.31,6.69 52.16,5.84 54.36,5.84 54.48,5.97 62.48,5.97 63.37,6.86 v79.25,6.86
I_SENSE3  (via drill 0.38)
  Top 0.254: v92.2,7.11 93.08,8 U3.P$8 | IC2.3 39.5,8.26 39.62,8.13 R9.1 C14.1 v42.67,6.69
  Bottom 0.254: v92.2,7.11 90.17,5.08 69.85,5.08 68.58,6.35 63.75,6.35 62.48,5.08 51.71,5.08 50.1,6.69 v42.67,6.69
N$2
  Top 0.254: R4.2 46.99,16.64 | 46.99,16.64 47.57,16.64 48.39,15.82 IC1.6 | 46.99,16.64 44.96,16.64 R10.P$1 JP2.1
N$4
  Top 0.254: R12.P$1 JP4.1 39.4,2.95 38.92,3.43 37.19,3.43 36.83,3.79 36.83,7.18 37.65,8 38.1,8 | IC2.2 38.23,8.13 38.1,8 | 38.1,8 R6.2
N$5
  Top 0.254: 46.99,7.75 46.3,7.75 45.85,7.29 45.85,3.82 46.47,3.2 49.11,3.2 49.43,2.88 JP3.1 R11.P$1 | IC1.2 47.12,7.87 46.99,7.75 | 46.99,7.75 R5.2
N$6
  Top 0.254: R2.1 75.44,27.91 U2.P$21
N$7
  Top 0.254: U2.P$32 70.63,19.2 70.23,18.8 70.23,16 70.83,15.41 C2.2
N$9
  Top 0.254: R3.1 90.69,27.91 U3.P$21
N$10
  Top 0.254: R1.1 60.2,27.91 U1.P$21
N$11
  Top 0.254: U1.P$32 55.46,19.2 54.99,18.73 54.99,15.96 55.21,15.75 C1.2
N$12
  Top 0.254: U3.P$32 85.94,19.2 85.47,18.73 85.47,16 85.94,15.53 C3.2
P_OUT1
  Top 0.61: U1.P$27 54.61,23.2 54.61,22.4 | 54.61,22.4 54.61,21.59 | 54.61,21.59 54.61,20.8 U1.P$30 | U1.P$29 54.61,21.59 | U1.P$28 54.61,22.4
  Top 1.27: 53.59,22.86 53.59,27.28 56.52,30.2 56.52,31.75 56.52,34.29 60.33,38.1 60.33,42.72 64.59,46.99 J1.1
  Top 2.184: D1.A 56.52,31.75 D2.C
  pour Top (isolate 0.305): 53.09,23.37 53.09,22.06 54.57,20.57 54.99,20.57 54.99,23.37
P_OUT2
  Top 0.61: U1.P$15 66.04,23.2 66.04,22.4 | 66.04,22.4 66.04,21.59 | 66.04,21.59 66.04,20.8 U1.P$12 | U1.P$13 66.04,21.59 | U1.P$14 66.04,22.4
  Top 1.27: 66.67,22.86 66.67,27.66 64.14,30.2 64.14,31.75 64.14,43 65.58,44.45 67,44.45 J1.2
  Top 2.184: D3.A 64.14,31.75 D4.C
  pour Top (isolate 0.305): 65.66,23.37 65.66,20.7 66.16,20.7 67.18,21.72 67.18,23.37
P_OUT3
  Top 0.61: U2.P$27 69.85,23.2 69.85,22.4 | 69.85,22.4 69.85,21.6 | 69.85,21.6 69.85,20.8 U2.P$30 | U2.P$28 69.85,22.4 | U2.P$29 69.85,21.6
  Top 1.27: 69.09,22.86 69.09,27.53 71.75,30.2 71.75,31.75 71.75,45.7 J1.3
  Top 2.184: D5.A 71.75,31.75 D6.C
  pour Top (isolate 0.305): 70.23,23.37 70.23,20.7 69.67,20.7 68.58,21.79 68.58,23.37
P_OUT4
  Top 0.61: U2.P$15 81.28,23.2 81.28,22.4 | 81.28,21.59 81.28,20.8 U2.P$12 | U2.P$13 81.28,21.59 | U2.P$14 81.28,22.4 | 81.28,22.4 81.28,21.59
  Top 1.27: 82.04,22.86 82.04,27.3 79.38,29.97 79.38,31.75 79.38,44.16 J1.4
  Top 2.184: D7.A 79.38,31.75 D8.C
  pour Top (isolate 0.305): 80.9,23.37 80.9,20.7 81.47,20.7 82.55,21.78 82.55,23.37
P_OUT5
  Top 0.61: U3.P$27 85.09,23.2 85.09,22.4 | 85.09,21.6 85.09,20.8 U3.P$30 | U3.P$28 85.09,22.4 | 85.09,22.4 85.09,21.6 | U3.P$29 85.09,21.6
  Top 1.27: 84.45,22.48 84.45,27.47 86.87,29.88 86.87,31.75 87,31.88 87,42.79 85.34,44.45 82.58,44.45 J1.5
  Top 2.184: D9.A 86.87,31.75 D10.C
  pour Top (isolate 0.305): 85.22,23.37 83.95,23.37 83.95,21.69 84.94,20.7 85.22,20.7
P_OUT6
  Top 0.61: U3.P$15 96.52,23.2 96.52,22.4 | 96.52,21.59 96.52,20.8 U3.P$12 | U3.P$13 96.52,21.59 | U3.P$14 96.52,22.4 | 96.52,22.4 96.52,21.59
  Top 1.27: 97.16,22.86 97.16,27.66 94.61,30.2 94.61,31.75 94.61,43.22 90.84,46.99 J1.6
  Top 2.184: D11.A 94.61,31.75 D12.C
  pour Top (isolate 0.305): 96.14,23.37 96.14,20.7 96.67,20.7 97.66,21.69 97.66,23.37
SLEW  (via drill 0.38)
  Top 0.254: U3.P$3 v89.08,10.54 | U2.P$3 v73.84,10.16 | U1.P$3 v58.6,10.54
  Bottom 0.254: v58.6,10.54 58.99,10.92 73.84,10.92 | 73.84,10.92 v73.84,10.16 | 73.84,10.92 88.7,10.92 v89.08,10.54 90.99,8.64 92.91,8.64 93.73,7.82 93.73,3.84 91.15,1.27 84.28,1.27 83.82,1.73 JP1.2
VCC
  Top 0.61: U3.P$6 91.48,16.66 90.82,16 90.68,16 | U3.P$4 89.89,16.66 90.55,16 90.68,16 | U2.P$6 76.25,16.72 75.66,16.13 75.44,16.13 | U2.P$4 74.64,16.69 75.21,16.13 75.44,16.13 | U1.P$6 61.01,16.7 60.43,16.13 60.2,16.13 | U1.P$4 59.41,16.69 59.97,16.13 60.2,16.13 | 97.79,17.78 97.79,18.69 96.48,20 U3.P$11 | 90.68,16 90.68,15.62 | U3.P$31 85.65,20 84.2,18.55 84.2,14.73 C3.1 84.24,5.18 81.66,5.18 81.66,18.83 80.5,20 U2.P$11 | U2.P$31 70.36,20 69.09,18.72 69.09,14.73 C2.1 69.13,5.18 | U1.P$11 65.52,20 66.93,18.59 C15.1 | 60.2,16.13 60.2,15.62 | 75.44,16.13 75.44,15.49 | U1.P$31 53.28,20 arc-90 53.15,20.13
  Top 1.016: C16.1 37.09,26.71 C17.1 U4.VIN
  Top 1.27: C4.1 90.68,5.18 90.68,15.62 | C5.1 75.44,5.18 75.44,15.49 | 60.2,15.62 C6.1
  Top 1.778: C4.1 C7.1 81.66,5.18 C5.1 C8.1 69.13,5.18 C15.1 C6.1 C9.1 57.38,5.18 53.51,9.05 C1.1 53.51,19.77 53.15,20.13 51.56,21.72 51.56,38.86 D1.C 57.78,45.09 57.78,46.99 | 90.68,5.18 93.32,5.18 97.79,9.65 97.79,17.78
  Bottom 0.254: 49.53,37.72 JP5.1
  Bottom 1.27: 57.8,44.58 57.28,44.58 D1.C 52.92,40.22 49.53,40.22 | 62.23,44.58 69.85,44.58 | 69.85,44.58 77.47,44.58 | 77.47,44.58 85.09,44.58 | 85.09,44.58 90.04,44.58 D11.C | D9.C 85.09,44.58 | D7.C 77.47,44.58 | D5.C 69.85,44.58 | D3.C 62.23,44.58 | 57.8,44.58 62.23,44.58 | J3.3 57.8,44.58 | 49.53,40.22 J2.PWR 39.37,38.06 U4.VIN | 49.53,40.22 49.53,37.72

### Text on the board
Bottom: v10
tPlace: 5V(1A) | GND | VCC | 1 | 2 | 3 | 4 | 5 | 6 | OUTPUT | VCC: 5-28VDC | I2 Gain | ESP32 Thing Power / Control Shield | I6 Gain | I4 Gain
bPlace: OUT1 | OUT6 | USB | BATT | 5V | BYPASS | Out 1 (25) | Disable Outputs (5) | Out 2 (18) | I-Sense 2 / (34) | Out 3 (23) | Out 4 (33) | Out 6 (19) | Out 5 (32) | I-Sense 4 / (39) | I-Sense 6 / (36) | SLEW RATE | SLOW | FAST
Measures: Units are in Inches
tDocu: Alex Wende | Copper Weight - 2 Ounce